# Altium schematic sheet Power.SchDoc
size A4; SheetNumber: 4; SheetTotal: 5
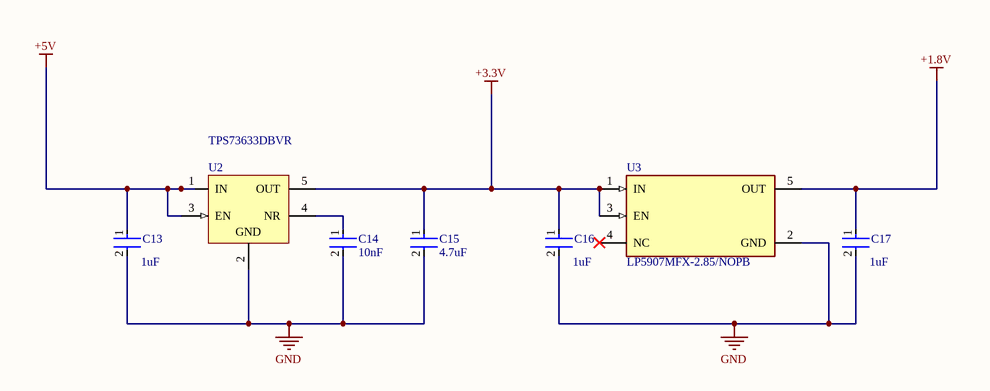
[diagram p0: Power.SchDoc]

## Parts
C13  Capacitance: 1uF  [FP-C0805C-DG-MFG]  (hidden comment: C0805C106K8PACTU)
C14  10nF  [FP-C0805C-DN-MFG]
C15  4.7uF  [FP-C0805C475K8PACTU-MFG]
C16  Capacitance: 1uF  [FP-C0805C-DG-MFG]  (hidden comment: C0805C106K8PACTU)
C17  Capacitance: 1uF  [FP-C0805C-DG-MFG]  (hidden comment: C0805C106K8PACTU)
U2  TPS73633DBVR  [DBV0005A_L]
U3  LP5907MFX-2.85/NOPB  [FP-DBV0005A-IPC_C]

## Nets
+1.8V: C17.1 U3.5(OUT)
+3.3V: C15.1 C16.1 U2.5(OUT) U3.1(IN) U3.3(EN)
+5V: C13.1 U2.1(IN) U2.3(EN)
GND: C13.2 C14.2 C15.2 C16.2 C17.2 U2.2(GND) U3.2(GND)
NetC14_1: C14.1 U2.4(NR)

Not connected (* = marked no-connect by the designer): U3 4(NC)*

## Library data of the parts
C13 C16 C17 = CMP-2007-03243-2: CAP CER 10UF 10V X5R 0805; Manufacturer: Kemet; 3DS Part Number: 220-00001; Tolerance: 10%; Temperature Coefficient: 15%; Material: Ceramic; Device Class L2: Capacitors; Device Class L1: Passive Components; ComponentLink2URL: https://content.kemet.com/datasheets/KEM_C1006_X5R_SMD.pdf; Height: 1.4mm; Lead Free: Yes; Manufacturer Part Number: C0805C106K8PACTU; Digikey Description: CAP CER 10UF 10V X5R 0805; Octopart: https://octopart.com/c0805c106k8pactu-kemet-98697; Value: 10uF; Temperature Range Low: -55°C; Temperature: -55°C to +85°C; Automotive: No; Mouser Description: CAP CER 10UF 10V X5R 0805; Ipc Land Pattern Name: CAPC200125X125; Temperature Range High: +85°C; Voltage: 10V; RoHS: TRUE; Device Class L3: Ceramic Capacitors; ComponentLink2Description: Datasheet; Voltage Rating: 10V; Package: C0805C-DG; Temperature Characteristic: X5R; Category: Cap
C14 = CMP-2007-00493-2: CAP CER 10000PF 25V 5% NP0 0805; Manufacturer: KEMET; Manufacturer Part Number: C0805C103J3GACTU; Capacitance: 10,000 pF; Tolerance: 0.05; Value: 10,000 pF; Material: Ceramic; Temperature Characteristic: C0G; Temperature Coefficient: 30ppm/°C; Octopart: https://octopart.com/c0805c103j3gactu-kemet-12563663; Lead Free: Yes; RoHS: TRUE; Package: C0805C-DN; Voltage Rating: 25 V; Ipc Land Pattern Name: CAPC200125X78; ComponentLink2URL: https://content.kemet.com/datasheets/KEM_C1003_C0G_SMD.pdf; Device Class L1: Passive Components; Category: Cap; ComponentLink2Description: Datasheet; Temperature Range High: +125°C; Height: 0.88mm; Temperature Range Low: -55°C; Device Class L3: Ceramic Capacitors; Digikey Description: CAP CER 10000PF 25V 5% NP0 0805; Device Class L2: Capacitors; Mouser Description: Multilayer Ceramic Capacitors MLCC - SMD/SMT 25volts 10000pF 5% C0G; Temperature: -55°C to +125°C; Automotive: No
C15 = CMP-2007-01007-2: CAP CER 4.7UF 10V X5R 0805; Dielectric Material: Ceramic; Dissipation Factor: 5%; Tolerance: 10%; Lead Pitch: 0.75mm; Mount: Surface Mount; Voltage Rating (DC): 10V; Length: 2mm; Case Code (Imperial): 0805; Height: 1.25mm; Package Quantity: 1; Thickness: 0.055inch; Depth: 1.25mm; Case Code (Metric): 2012; Termination: SMD/SMT; Construction: Flat; Dielectric: X5R; Series: C; Capacitance: 4.7uF; Width: 1.2mm; Max Operating Temperature: 85°C; Packaging: Tape and Reel; Voltage Rating: 10V; REACH SVHC: No SVHC; Min Operating Temperature: -55°C; Number of Pins: 2; Case/Package: 0805; Radiation Hardening: No; Lead Free: Lead Free; Voltage: 10V; RoHS Compliant: Yes
U2 = CMP-0395-00256-2: Single Output Low Noise LDO, 400 mA, Fixed 3.3 V Output, 1.7 to 5.5 V Input, with Reverse Current Protection, 5-pin SOT-23 (DBV), -40 to 85 degC, Green (RoHS & no Sb/Br); Manufacturer: Texas Instruments; Vin(Min)(V): 1.7; Vdo(Typ)(mV): 75; Iq(Typ)(mA): 0.3; SubFamily: Single Channel LDO; Vout Adj(Max)(V): 3.3; Accuracy(%): 1; Vin(Max)(V): 5.5; Iout(Max)(A): 0.4; Rating: Catalog; ComponentLink1Description: Manufacturer URL; PartNumber: TPS73633DBVR; PackageDescription: 5-Pin Plastic Small Outline, Body 1.60 Ãƒâ€” 2.90 mm, Pitch 0.95 mm; ComponentLink3URL: http://www.ti.com/litv/pdf/mpds018i; ComponentLink2Description: Datasheet; ComponentLink4Description: URL Link1; DatasheetVersion: SBVS038T; Vout Adj(Min)(V): 3.3; Code_JEDEC: MO-178; Fixed Output Options(V): 3.3; Eco-Plan: Green (RoHS & no Sb/Br); PackageReference: DBV0005A; ComponentLink4URL: Samples URL:http://www.ti.com/product/tps73633#samples; PackageVersion: 4073253-4/K; ComponentLink2URL: http://www.ti.com/general/docs/lit/getliterature.tsp?genericPartNumber=TPS73633&fileType=pdf; ComponentLink1URL: http://www.ti.com/; ComponentLink3Description: Package Specification; Mounting Technology: Surface Mount
U3 = CMP-04917-000259-2: IC REG LIN 2.85V 250MA SOT23-5; Number of Outputs: 1; Min Input Voltage: 2.2V; Output Type: Fixed; Power Supply Rejection Ratio (PSRR): 82dB; Max Input Voltage: 5.5V; Quiescent Current: 12uA; Dropout Voltage: 250mV; Output Current: 250mA; Packaging: Tape and Reel; Max Operating Temperature: 125°C; Min Operating Temperature: -40°C; RoHS Compliant: Yes; Package Quantity: 3000; Lead Free: Lead Free; Output Voltage: 2.85V; Case/Package: SOT-23-5